# EasyEDA Pro project pcbs.epro

# Schematic Schematic1
Board Name: Mainboard; Create Date: 2025-03-07; Page Name: P1; Project Name: StratoSpore; Schematic Name: Schematic1; Update Date: 2025-05-23; Company: EasyEDA.com; Page Size: A4; Version: V1.0
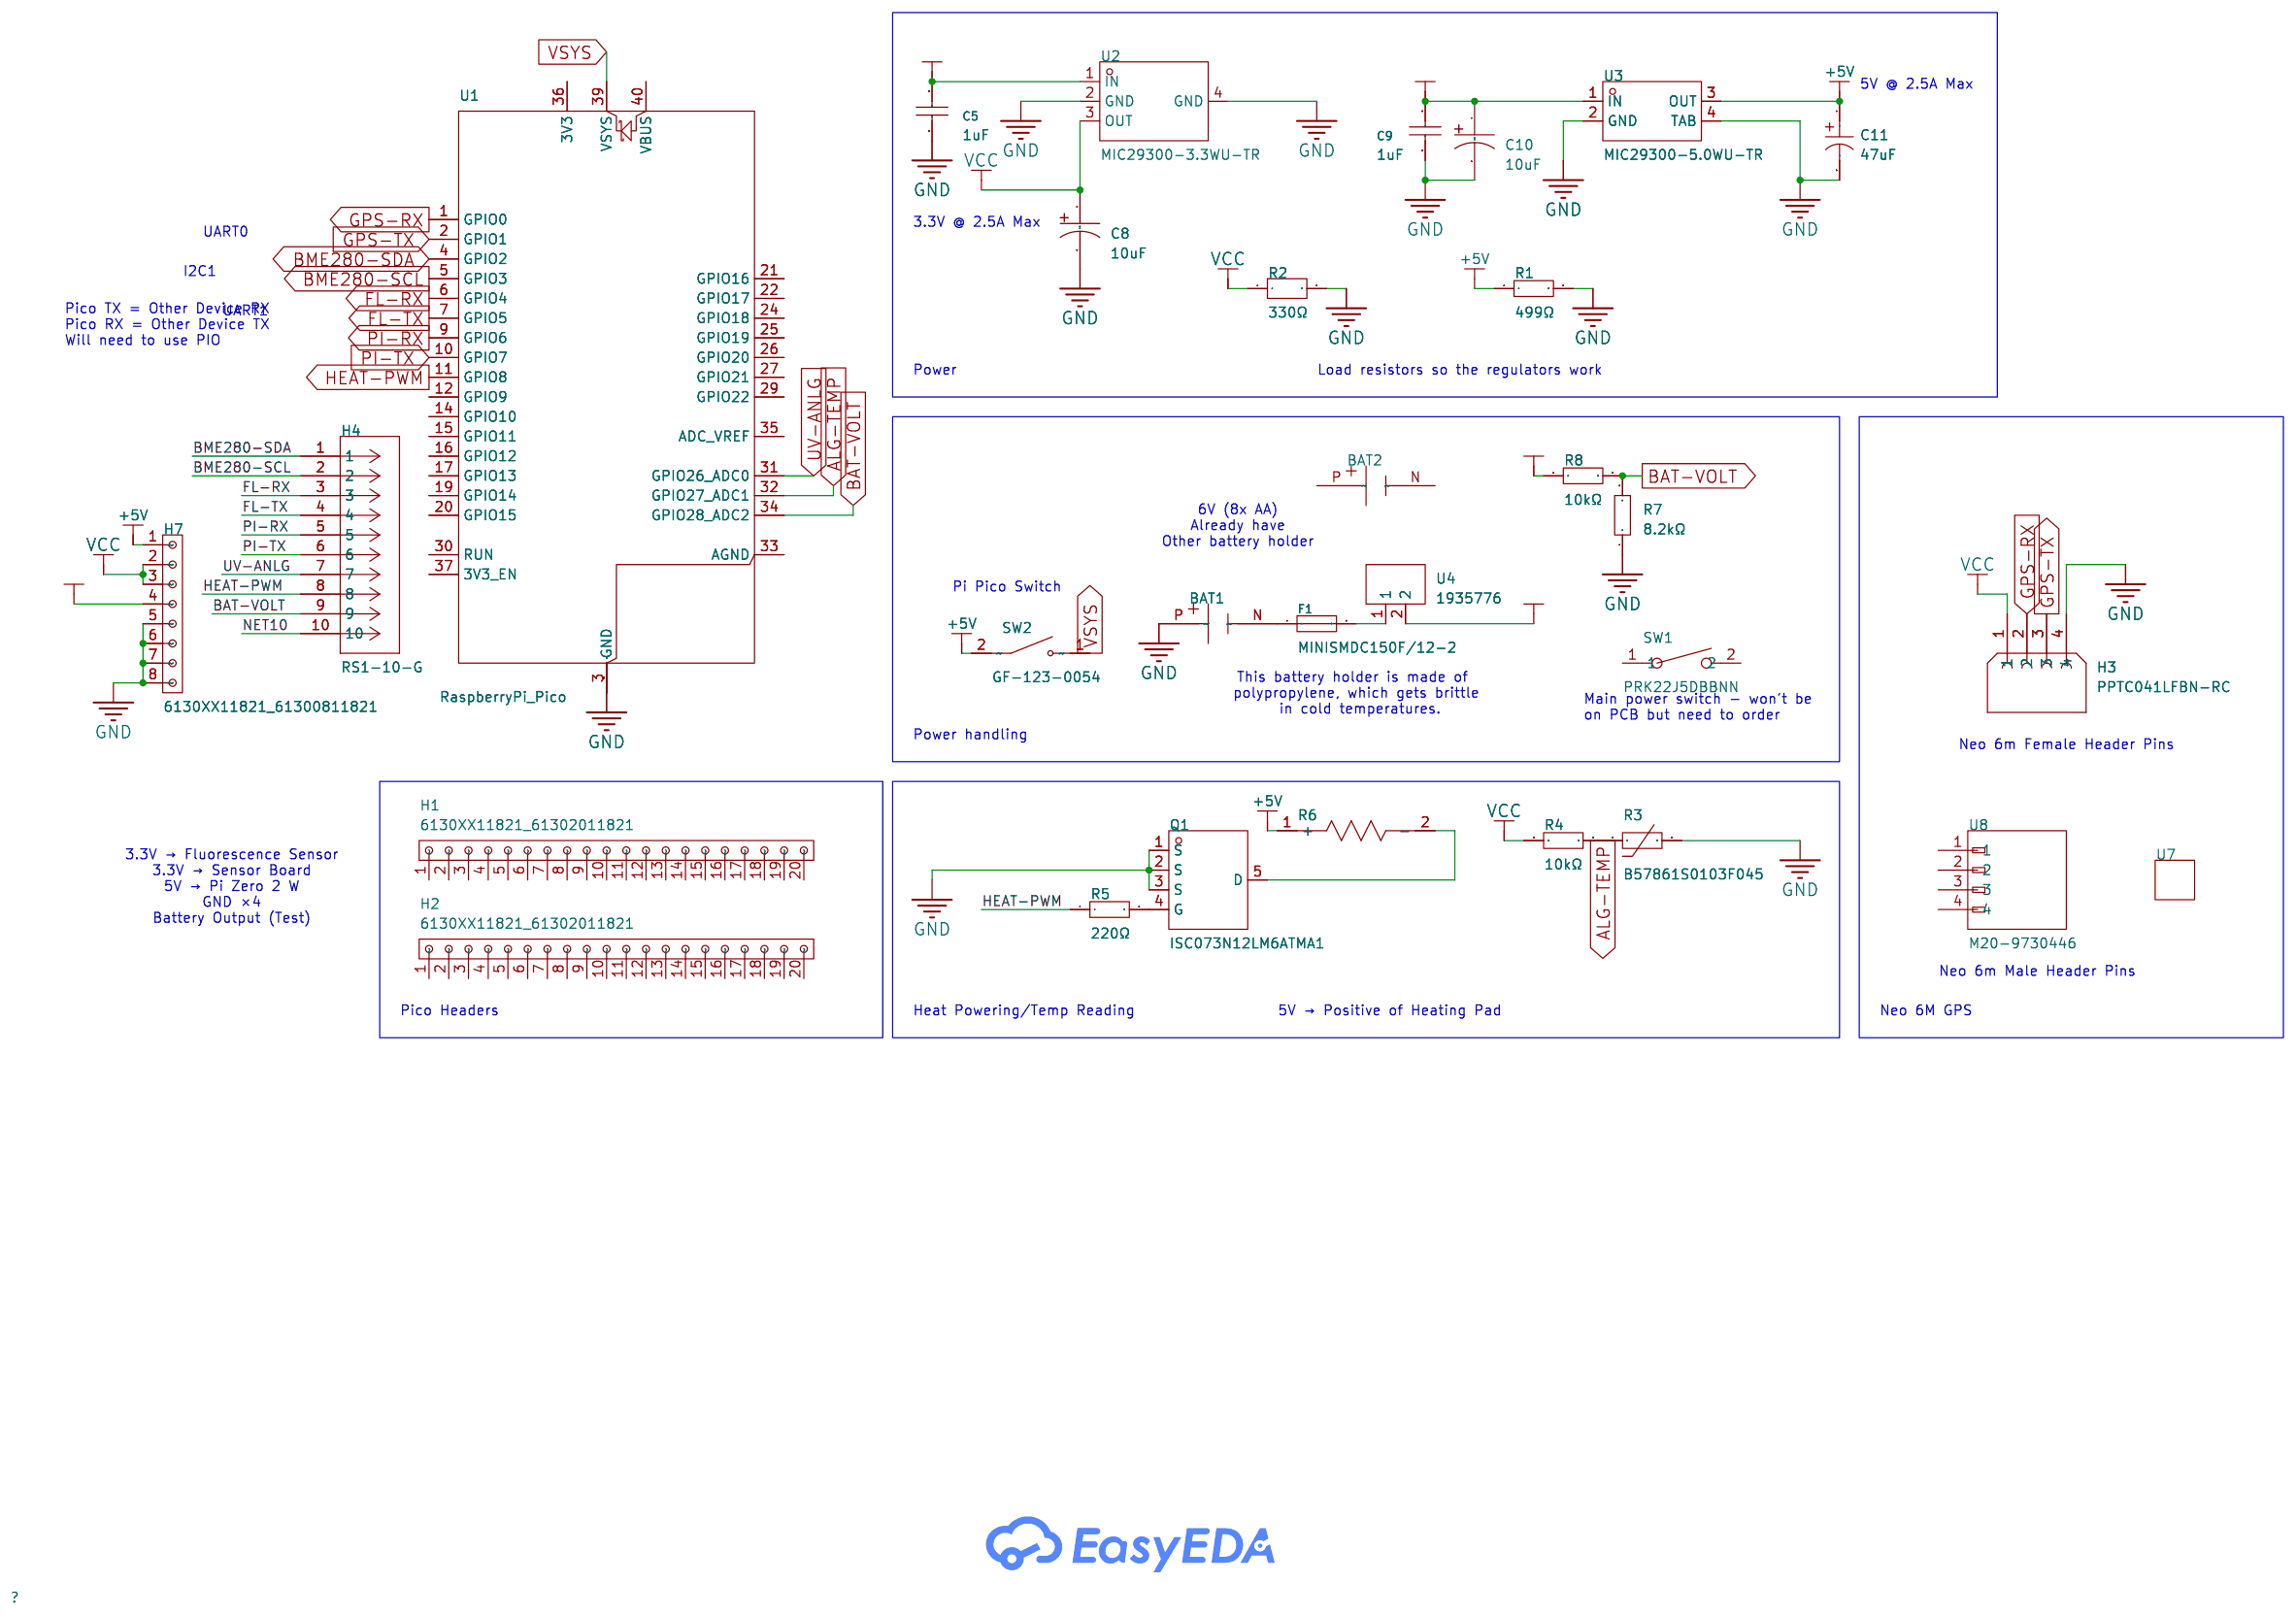
[diagram p0: schematic sheet]

## Parts
BAT1  -  [2478]
BAT2  -  [2478]
C5  1uF  [C0805]
C8  10uF  [CAP-SMD_L6.0-W3.2-R-RD]
C9  1uF  [C0805]
C10  10uF  [CAP-SMD_L6.0-W3.2-R-RD]
C11  47uF  [CAP-SMD_L7.3-W4.3-R-RD]
F1  MINISMDC150F/12-2  [F1812]
H1  6130XX11821_61302011821  [61302011821]
H2  6130XX11821_61302011821  [61302011821]
H3  PPTC041LFBN-RC  [SULLINS_PPTC041LFBN-RC]
H4  RS1-10-G  [CONN_RS1-10-G_ADM]
H7  6130XX11821_61300811821  [61300811821]
Q1  ISC073N12LM6ATMA1  [TDSON-8_L5.9-W5.2-P1.27-BL]
R1  499Ω  [R0603]
R2  330Ω  [R0603]
R3  B57861S0103F045  [RES-TH_BD2.4-P1.50-D0.3]
R4  10kΩ  [R0603]
R5  220Ω  [R0805]
R6  -  [1481]
R7  8.2kΩ  [R0603]
R8  10kΩ  [R0603]
SW1  PRK22J5DBBNN  [SW_PRK22J5DBBNN_ZFE]
SW2  GF-123-0054  [SW_GF-123-0054]
U1  RaspberryPi_Pico  [RaspberryPi_Pico_Common]
U2  MIC29300-3.3WU-TR  [TO-263-3_L8.6-W10.2-P2.54-LS14.4-BR]
U3  MIC29300-5.0WU-TR  [TO-263-3L_L10.2-W8.7-P2.54-LS15.3-BL-A]
U4  1935776  [CONN-TH_2P-P5.00_1935776]
U7  -  [neo 6m breakout]  (no BOM)
U8  M20-9730446  [HARWIN_M20-9730446]

## Library data of the parts
BAT1 BAT2 = 2478: Supplier Part: 36-2478-ND; Manufacturer: Keystone Electronics
C5 C9 = CC0805KKX7R8BB105: Capacitance: Tolerance:±10% Tolerance:±10% Voltage Rated: Temperature Coefficient:; LCSC Part Name: 1uF ±10% 25V; Supplier Part: C91186; Manufacturer: YAGEO(国巨); Supplier Footprint: 0805; JLCPCB Part Class: Extended Part; Datasheet: https://atta.szlcsc.com/upload/public/pdf/source/20170505/1493957848374.pdf; Supplier: LCSC; Tolerance: ±10%
C8 C10 = 293D106X0025C2TE3: Capacitance: Tolerance:±20% Tolerance:±20% Rated Voltage: Equivalent Series Resistance(ESR):1.5Ω@100kHz Operating Temperature:-55℃~+125℃ Operating Temperature:-55℃~+125℃; LCSC Part Name: 10uF ±20% 25V; Supplier Part: C506622; Manufacturer: VISHAY(威世); Supplier Footprint: CASE-C-6032; JLCPCB Part Class: Extended Part; Datasheet: https://atta.szlcsc.com/upload/public/pdf/source/20200402/C506568_4FDD8873788A7E9395A87829360D29B4.pdf; Supplier: LCSC; Tolerance: ±20%; Equivalent Series Resistance(ESR): 1.5Ω@100kHz; Operating Temperature: -55℃~+125℃
C11 = 293D476X9025E2TE3: Capacitance: Tolerance:±10% Tolerance:±10% Rated Voltage: Leakage Current(DCL):- Ripple Current:- Equivalent Series Resistance(ESR):600mΩ Operating Temperature:-55℃~+125℃ Operating Temperature:-55℃~+125℃; LCSC Part Name: 47uF ±10% 25V; Supplier Part: C1970968; Manufacturer: VISHAY(威世); Supplier Footprint: 2917; JLCPCB Part Class: Extended Part; Datasheet: https://atta.szlcsc.com/upload/public/pdf/source/20210430/5F5654738936DAF6EE15800967345E6B.pdf; Supplier: LCSC; Tolerance: ±10%; Equivalent Series Resistance(ESR): 600mΩ; Operating Temperature: -55℃~+125℃
F1 = MINISMDC150F/12-2: Operating Voltage (Max):12V Current Rating (Max):100A Hold Current:1.5A Trip Current:2.8A Power Dissipation:0.8W Resistance - Initial (Ri) (Min):40mΩ Resistance - Post Trip (R1) (Max):110mΩ Maximum Time to Trip:500ms Operating Temperature:-40℃~+85℃ Operat; LCSC Part Name: 12V 1.5A 1812自恢复; Supplier Part: C720177; Manufacturer: Littelfuse(美国力特); Supplier Footprint: 1812; JLCPCB Part Class: Extended Part; Datasheet: https://atta.szlcsc.com/upload/public/pdf/source/20190419/C207207_EAF573CD7DACFF875028B56E1335F153.pdf; Supplier: LCSC; Operating Voltage (Max): 12V; Current Rating (Max): 100A; Hold Current: 1.5A; Trip Current: 2.8A; Power Dissipation: 0.8W; Resistance - Initial (Ri) (Min): 40mΩ; Resistance - Post Trip (R1) (Max): 110mΩ; Maximum Time to Trip: 500ms; Operating Temperature: -40℃~+85℃
H1 H2 = 6130XX11821_61302011821: Supplier Part: 732-61302011821-ND; Manufacturer: Würth Elektronik
H3 = PPTC041LFBN-RC: Manufacturer: Sullins Connector Solutions; Supplier Part: S7002-ND
H4 = RS1-10-G: Manufacturer: Adam Tech; Supplier Part: 2057-RS1-10-G-ND
H7 = 6130XX11821_61300811821: Manufacturer: Würth Elektronik; Supplier Part: 732-61300811821-ND
Q1 = ISC073N12LM6ATMA1: Supplier Part: C20191682; Manufacturer: Infineon(英飞凌); Supplier Footprint: TDSON-8; JLCPCB Part Class: Extended Part; Datasheet: https://atta.szlcsc.com/upload/public/pdf/source/20240125/F6CF7D3B0298D52D159E06BBD68239CB.pdf; Supplier: LCSC
R1 = RC0603FR-07499RL: Type:Thick Film Resistors Resistance: Tolerance:±1% Tolerance:±1% Power(Watts): Overload Voltage (Max): Temperature Coefficient:±100ppm/℃ Temperature Coefficient:±100ppm/℃ Operating Temperature Range:-55℃~+155℃ Operating Temperature Range:-55℃~+155℃; LCSC Part Name: 厚膜电阻 499Ω ±1% 100mW; Supplier Part: C137714; Manufacturer: YAGEO(国巨); Supplier Footprint: 0603; JLCPCB Part Class: Extended Part; Datasheet: https://atta.szlcsc.com/upload/public/pdf/source/20180821/C275644_0D56F95EFF785E7D9A1FEF436B37DA78.pdf; Supplier: LCSC; Type: Thick Film Resistors; Tolerance: ±1%; Temperature Coefficient: ±100ppm/℃; Operating Temperature Range: -55℃~+155℃
R2 = AC0603FR-7W330RL: Type:Thick Film Resistors Resistance: Tolerance:±1% Tolerance:±1% Power(Watts): Temperature Coefficient:±100ppm/℃ Temperature Coefficient:±100ppm/℃ Operating Temperature:-55℃~+155℃ Operating Temperature:-55℃~+155℃; LCSC Part Name: 厚膜电阻 330Ω ±1% 200mW; Supplier Part: C513549; Manufacturer: YAGEO(国巨); Supplier Footprint: 0603; JLCPCB Part Class: Extended Part; Datasheet: https://atta.szlcsc.com/upload/public/pdf/source/20200720/C226560_9AA3C698ADB253A5478F88745DBE7B87.pdf; Supplier: LCSC; Type: Thick Film Resistors; Tolerance: ±1%; Temperature Coefficient: ±100ppm/℃; Operating Temperature: -55℃~+155℃
R3 = B57861S0103F045: Resistance @ 25℃:10kΩ B Constant (25℃/100℃):3988K Power(Watts):60mW B Constant Tolerance:±0.3% Operating Temperature:-55℃~+155℃ Operating Temperature:-55℃~+155℃; Supplier Part: C3153632; Manufacturer: TDK; JLCPCB Part Class: Extended Part; Datasheet: https://atta.szlcsc.com/upload/public/pdf/source/231023/C17239155-3a32f035bd59906d9ea9e0c8483bf3a3.pdf; Supplier: LCSC; Resistance @ 25℃: 10kΩ; B Constant (25℃/100℃): 3988K; Power(Watts): 60mW; B Constant Tolerance: ±0.3%; Operating Temperature: -55℃~+155℃
R4 = RC0603FR-0710KL: Type:Thick Film Resistors Resistance: Tolerance:±1% Tolerance:±1% Power(Watts): Overload Voltage (Max): Temperature Coefficient:±100ppm/℃ Temperature Coefficient:±100ppm/℃ Operating Temperature Range:-55℃~+155℃ Operating Temperature Range:-55℃~+155℃; LCSC Part Name: 厚膜电阻 10kΩ ±1% 100mW; Supplier Part: C98220; Manufacturer: YAGEO(国巨); Supplier Footprint: 0603; JLCPCB Part Class: Extended Part; Datasheet: https://atta.szlcsc.com/upload/public/pdf/source/20180927/C295883_E8D83085EA81BD7DE0B2B681138C15EE.pdf; Supplier: LCSC; Type: Thick Film Resistors; Tolerance: ±1%; Temperature Coefficient: ±100ppm/℃; Operating Temperature Range: -55℃~+155℃
R5 = RC0805JR-7W220RL: Type:Thick Film Resistors Resistance: Tolerance:±5% Tolerance:±5% Power(Watts):250mW Overload Voltage (Max): Temperature Coefficient:±100ppm/℃ Temperature Coefficient:±100ppm/℃ Operating Temperature Range:-55℃~+155℃ Operating Temperature Range:-55℃~+155℃; LCSC Part Name: 厚膜电阻 220Ω ±5% 250mW; Supplier Part: C163392; Manufacturer: YAGEO(国巨); Supplier Footprint: 0805; JLCPCB Part Class: Extended Part; Datasheet: https://atta.szlcsc.com/upload/public/pdf/source/20181009/C309620_DA5935B6E1D48212CB7A533FE518B3C2.pdf; Supplier: LCSC; Type: Thick Film Resistors; Tolerance: ±5%; Power(Watts): 250mW; Temperature Coefficient: ±100ppm/℃; Operating Temperature Range: -55℃~+155℃
R6 = 1481: Supplier Part: 1528-1481AD-ND; Manufacturer: Adafruit Industries LLC
R7 = RC0603JR-078K2L: Type:Thick Film Resistors Resistance: Tolerance:±5% Tolerance:±5% Power(Watts): Overload Voltage (Max): Temperature Coefficient:±100ppm/℃ Temperature Coefficient:±100ppm/℃ Operating Temperature Range:-55℃~+155℃ Operating Temperature Range:-55℃~+155℃; LCSC Part Name: 厚膜电阻 8.2kΩ ±5% 100mW; Supplier Part: C137605; Manufacturer: YAGEO(国巨); Supplier Footprint: 0603; JLCPCB Part Class: Extended Part; Datasheet: https://atta.szlcsc.com/upload/public/pdf/source/20180821/C275644_0D56F95EFF785E7D9A1FEF436B37DA78.pdf; Supplier: LCSC; Type: Thick Film Resistors; Tolerance: ±5%; Temperature Coefficient: ±100ppm/℃; Operating Temperature Range: -55℃~+155℃
R8 = RC0603FR-7W10KL: Type:Thick Film Resistors Resistance: Tolerance:±1% Tolerance:±1% Power(Watts): Overload Voltage (Max): Temperature Coefficient:±200ppm/℃ Temperature Coefficient:±200ppm/℃ Operating Temperature Range:-55℃~+155℃ Operating Temperature Range:-55℃~+155℃; LCSC Part Name: 厚膜电阻 10kΩ ±1% 200mW; Supplier Part: C859110; Manufacturer: YAGEO(国巨); Supplier Footprint: 0603; JLCPCB Part Class: Extended Part; Datasheet: https://atta.szlcsc.com/upload/public/pdf/source/20200729/C77617_95A5CB0DA5B36E247059EF653C0CC0E3.pdf; Supplier: LCSC; Type: Thick Film Resistors; Tolerance: ±1%; Temperature Coefficient: ±200ppm/℃; Operating Temperature Range: -55℃~+155℃
SW1 = PRK22J5DBBNN: Supplier Part: CH865-ND
SW2 = GF-123-0054: Manufacturer: CW Industries; Supplier Part: CWI333-ND
U1 = RaspberryPi_Pico
U2 = MIC29300-3.3WU-TR: Output Type:Fixed Maximum Input Voltage:26V Output Voltage:3.3V Output Voltage:3.3V Output Current:3A Power Supply Rejection Ratio (PSRR):- Dropout Voltage:600mV@(3A) Feature:ESD Protection；Thermal Protection(TSD)；Overcurrent Protection(OCP)；Overvoltage P; LCSC Part Name: 输入26V 输出3.3V 3A; Supplier Part: C481370; Manufacturer: MICROCHIP(美国微芯); Supplier Footprint: TO-263-3; JLCPCB Part Class: Extended Part; Datasheet: https://atta.szlcsc.com/upload/public/pdf/source/20210319/C632728_21C2D58688A9F27E0B2DBAFC6F66A269.pdf; Supplier: LCSC; Output Type: Fixed; Maximum Input Voltage: 26V; Output Voltage: 3.3V; Output Current: 3A; Dropout Voltage: 600mV@(3A); Feature: ESD Protection；Thermal Protection(TSD)；Overcurrent Protection(OCP)；Overvoltage Protection (OVP); Operating Temperature: -40℃~+125℃; Output Polarity: Positive electrode; Number of Outputs: 1
U3 = MIC29300-5.0WU-TR: Output Type:Fixed Maximum Input Voltage:26V Output Voltage:5V Output Voltage:5V Output Current:3A Dropout Voltage:600mV@(3A) Feature:ESD Protection；Thermal Protection(TSD)；Overcurrent Protection(OCP)；Overvoltage Protection (OVP) Operating Temperature:-40℃; Supplier Part: C632729; Manufacturer: MICROCHIP(美国微芯); Supplier Footprint: TO-263-3; JLCPCB Part Class: Extended Part; Datasheet: https://atta.szlcsc.com/upload/public/pdf/source/20210319/C632728_21C2D58688A9F27E0B2DBAFC6F66A269.pdf; Supplier: LCSC; Output Type: Fixed; Maximum Input Voltage: 26V; Output Voltage: 5V; Output Current: 3A; Dropout Voltage: 600mV@(3A); Feature: ESD Protection；Thermal Protection(TSD)；Overcurrent Protection(OCP)；Overvoltage Protection (OVP); Operating Temperature: -40℃~+125℃; Output Polarity: Positive electrode; Number of Outputs: 1
U4 = 1935776: Number of Positions or Pins:1x2P Pitch:5mm Color:Green Mounting Type:Direct Insert Number of Pins:2P Number of Rows:1 Number of PINs Per Row:2 Current Rating:20A Voltage Rating (Max):300V Wire Gauge - AWG:12~20 Wire Gauge - AWG:12~20 Operating Temperature; LCSC Part Name: 5mm 1x2P 排数:1 每排P数:2 直插; Supplier Part: C3817389; Manufacturer: Phoenix Contact(菲尼克斯); Supplier Footprint: 插件,P=5mm; JLCPCB Part Class: Extended Part; Datasheet: https://atta.szlcsc.com/upload/public/pdf/source/20241031/6A5BF2121E40199BEDD4CC643D0B5C53.pdf; Supplier: LCSC; Number of Positions or Pins: 1x2P; Pitch: 5mm; Color: Green; Mounting Type: Direct Insert; Number of Pins: 2P; Number of Rows: 1; Number of PINs Per Row: 2; Current Rating: 20A; Voltage Rating (Max): 300V; Wire Gauge - AWG: 12~20
U7 = neo 6m breakout
U8 = M20-9730446

## Nets
+5V: C11.1 H7.1 R1.1 R6.1(+) SW2.2 U3.3(OUT)
+6V: C5.2 C9.2 C10.1 H7.4 R8.1 U2.1(IN) U3.1(IN) U4.2
GND: BAT1.P C5.1 C8.2 C9.1 C10.2 C11.2 H3.4 H7.5 H7.6 H7.7 H7.8 Q1.1(S) Q1.2(S) Q1.3(S) R1.2 R2.2 R3.2 R7.1 U1.3(GND) U1.8(GND) U1.13(GND) U1.18(GND) U1.23(GND) U1.28(GND) U1.38(GND) U2.2(GND) U2.4(GND) U3.2(GND) U3.4(TAB)
VCC: C8.1 H3.1 H7.2 H7.3 R2.1 R4.1 U2.3(OUT)
ALG-TEMP: R3.1 R4.2 U1.32(GPIO27_ADC1)
BAT-VOLT: H4.9 R7.2 R8.2 U1.34(GPIO28_ADC2)
BME280-SCL: H4.2 U1.5(GPIO3)
BME280-SDA: H4.1 U1.4(GPIO2)
FL-RX: H4.3 U1.6(GPIO4)
FL-TX: H4.4 U1.7(GPIO5)
GPS-RX: H3.2 U1.1(GPIO0)
GPS-TX: H3.3 U1.2(GPIO1)
HEAT-PWM: H4.8 R5.1 U1.11(GPIO8)
NET10: H4.10
PI-RX: H4.5 U1.9(GPIO6)
PI-TX: H4.6 U1.10(GPIO7)
UV-ANLG: H4.7 U1.31(GPIO26_ADC0)
VSYS: SW2.1 U1.39(VSYS)
$1N15688: F1.2 U4.1
$1N19014: Q1.4(G) R5.2
$1N19161: Q1.5(D) R6.2(-)
$1N22706: BAT1.N F1.1

Not connected (* = marked no-connect by the designer): BAT2 N P; H1 1 2 3 4 5 6 7 8 9 10 11 12 13 14 15 16 17 18 19 20; H2 1 2 3 4 5 6 7 8 9 10 11 12 13 14 15 16 17 18 19 20; SW1 1 2; U1 12(GPIO9) 14(GPIO10) 15(GPIO11) 16(GPIO12) 17(GPIO13) 19(GPIO14) 20(GPIO15) 21(GPIO16) 22(GPIO17) 24(GPIO18) 25(GPIO19) 26(GPIO20) 27(GPIO21) 29(GPIO22) 30(RUN) 33(AGND) 35(ADC_VREF) 36(3V3) 37(3V3_EN) 40(VBUS); U8 1 2 3 4

## Notes on the sheet
- 5V @ 2.5A Max
- 3.3V @ 2.5A Max
- UART0
- I2C1
- UART1
- Pico TX = Other Device RX
  Pico RX = Other Device TX
  Will need to use PIO
- Power
- Load resistors so the regulators work
- 6V (8x AA)
  Already have
  Other battery holder
- Pi Pico Switch
- This battery holder is made of
  polypropylene, which gets brittle
   in cold temperatures.
- Main power switch - won't be
  on PCB but need to order
- Power handling
- Neo 6m Female Header Pins
- 3.3V → Fluorescence Sensor
  3.3V → Sensor Board
  5V → Pi Zero 2 W
  GND ×4
  Battery Output (Test)
- Neo 6m Male Header Pins
- Pico Headers
- Heat Powering/Temp Reading
- 5V → Positive of Heating Pad
- Neo 6M GPS

# Schematic Schematic2
Board Name: FluorescenceDetector; Create Date: 2025-03-17; Page Name: P1; Project Name: StratoSpore; Schematic Name: Schematic2; Update Date: 2025-05-09; Company: EasyEDA.com; Page Size: A4; Version: V1.0
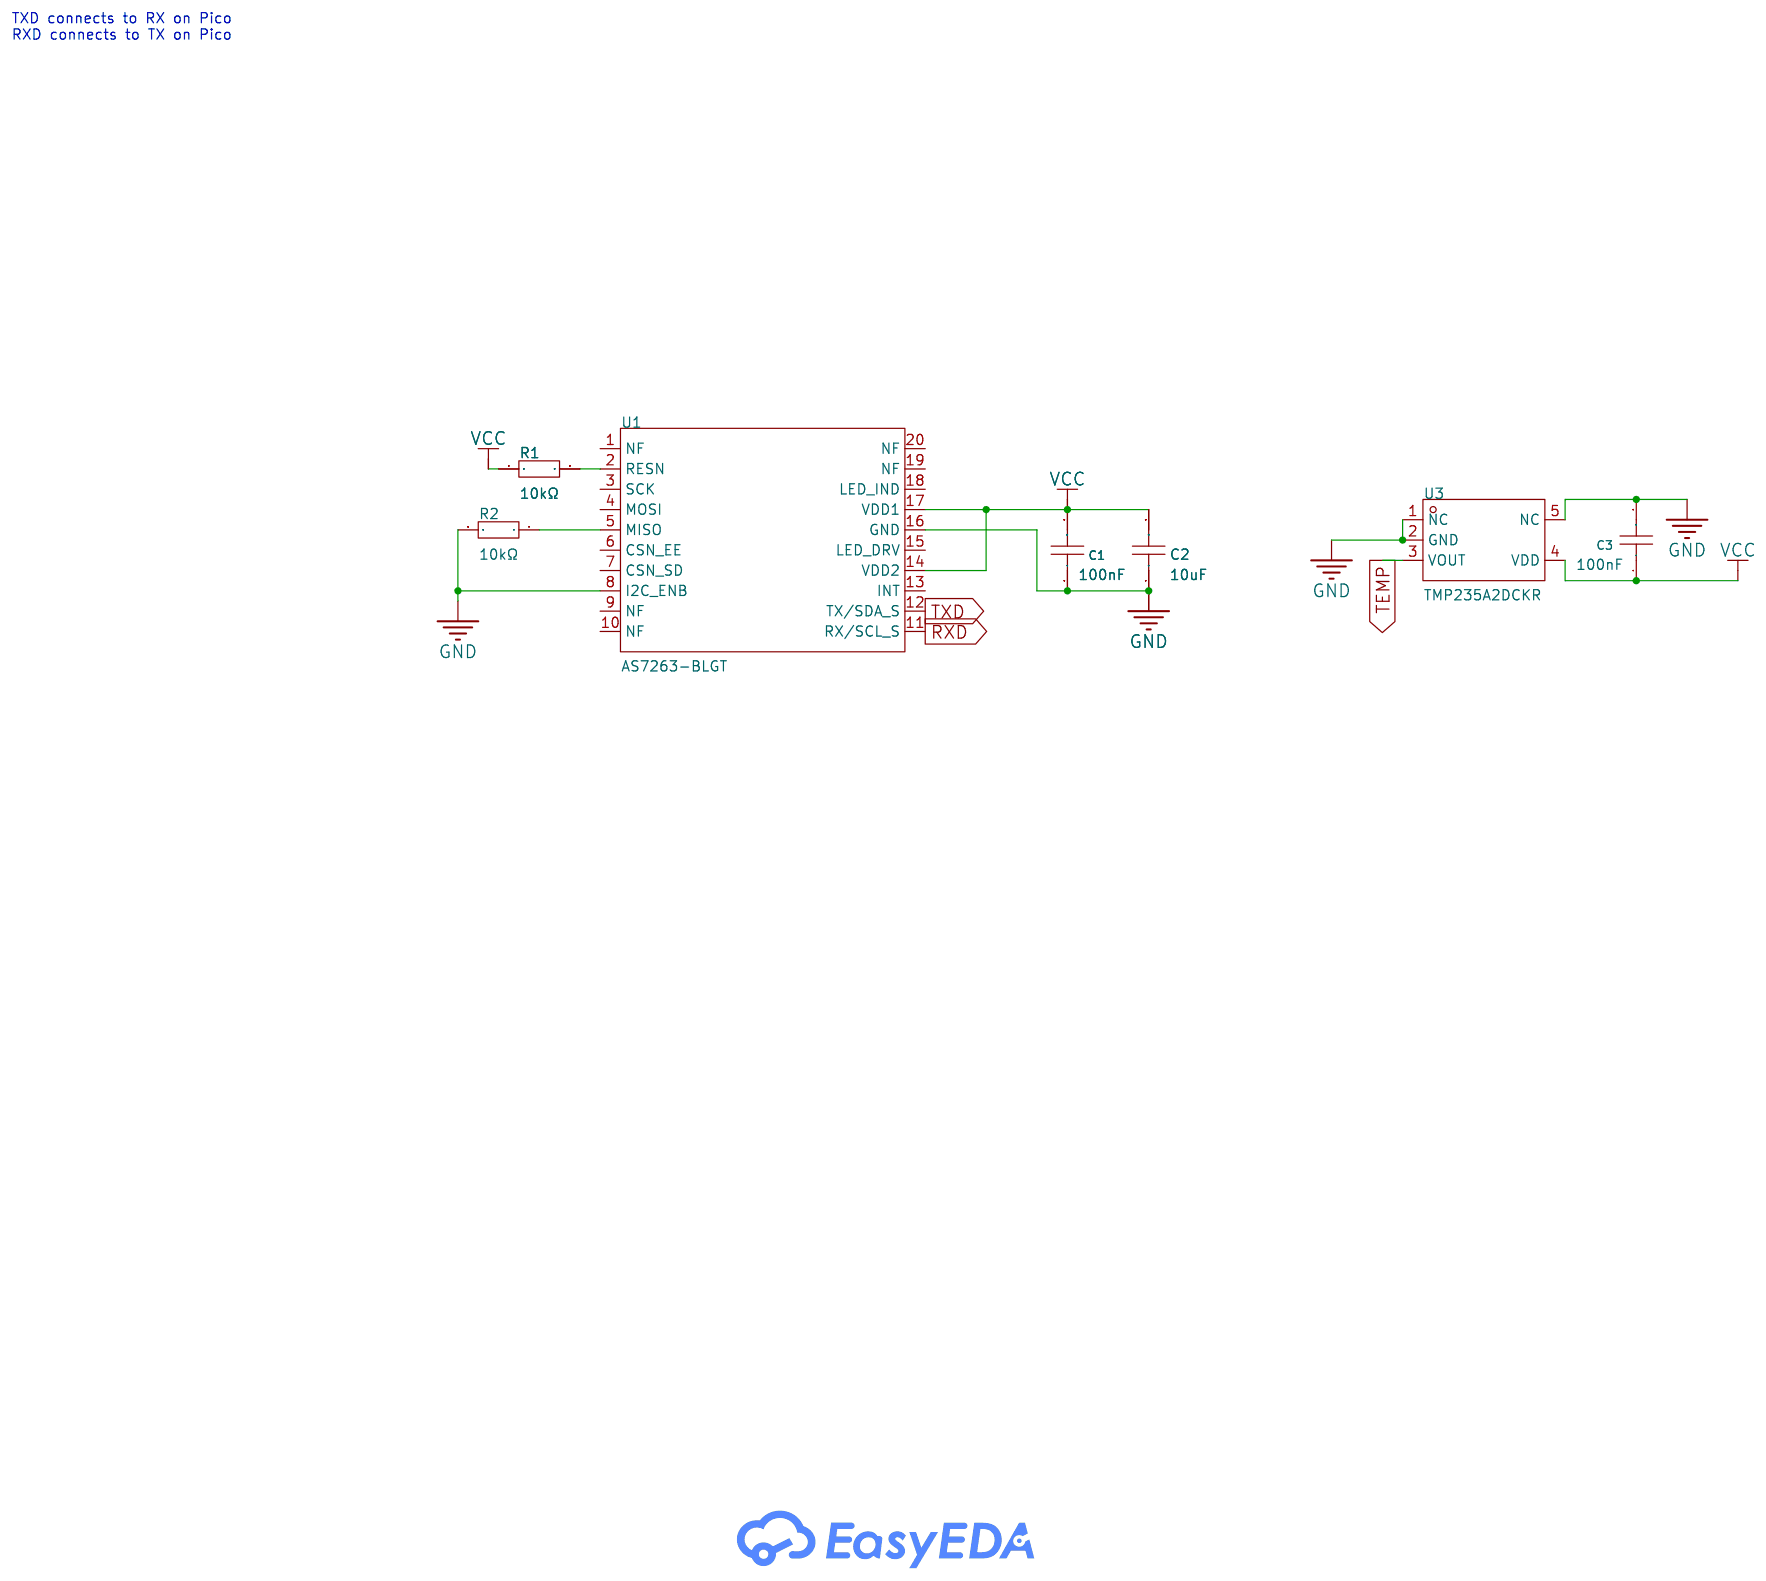
[diagram p1: schematic sheet]

## Parts
C1  100nF  [C0603]
C2  10uF  [C0603]
C3  100nF  [C0603]
R1  10kΩ  [R0603]
R2  10kΩ  [R0603]
U1  AS7263-BLGT  [LGA-20_L4.7-W4.5-P0.65-TL]
U3  TMP235A2DCKR  [SC-70-5_L2.0-W1.3-P0.65-LS2.1-BR]

## Library data of the parts
C1 C3 = CC0603JRX7R8BB104: Capacitance: Tolerance:±5% Tolerance:±5% Voltage Rated: Temperature Coefficient:; LCSC Part Name: 100nF ±5% 25V; Supplier Part: C327087; Manufacturer: YAGEO(国巨); Supplier Footprint: 0603; JLCPCB Part Class: Extended Part; Datasheet: https://atta.szlcsc.com/upload/public/pdf/source/20181031/C327087_3904F8991912FFA736313896A6BE2AA9.pdf; Supplier: LCSC; Tolerance: ±5%
C2 = LMK107BBJ106MALT: Capacitance: Tolerance:±20% Tolerance:±20% Voltage Rating: Temperature Coefficient:; LCSC Part Name: MSASL168BB5106MTNB33 10uF ±20% 10V; Supplier Part: C195004; Manufacturer: TAIYO YUDEN(太诱); Supplier Footprint: 0603; JLCPCB Part Class: Extended Part; Datasheet: https://atta.szlcsc.com/upload/public/pdf/source/20210525/C2802164_C0429B055888A674C3F00BA74B841C5B.pdf; Supplier: LCSC; Tolerance: ±20%
R1 R2 = RC0603FR-0710KL: Type:Thick Film Resistors Resistance: Tolerance:±1% Tolerance:±1% Power(Watts): Overload Voltage (Max): Temperature Coefficient:±100ppm/℃ Temperature Coefficient:±100ppm/℃ Operating Temperature Range:-55℃~+155℃ Operating Temperature Range:-55℃~+155℃; LCSC Part Name: 厚膜电阻 10kΩ ±1% 100mW; Supplier Part: C98220; Manufacturer: YAGEO(国巨); Supplier Footprint: 0603; JLCPCB Part Class: Extended Part; Datasheet: https://atta.szlcsc.com/upload/public/pdf/source/20180927/C295883_E8D83085EA81BD7DE0B2B681138C15EE.pdf; Supplier: LCSC; Type: Thick Film Resistors; Tolerance: ±1%; Temperature Coefficient: ±100ppm/℃; Operating Temperature Range: -55℃~+155℃
U1 = AS7263-BLGT: Voltage - Supply:2.7V~3.6V Voltage - Supply:2.7V~3.6V Operating Temperature:-40℃~+85℃ Operating Temperature:-40℃~+85℃; LCSC Part Name: AS7263 BLGT; Supplier Part: C2655137; Manufacturer: ams(艾迈斯半导体); Supplier Footprint: LGA-20(4.5x4.7); JLCPCB Part Class: Extended Part; Datasheet: https://atta.szlcsc.com/upload/public/pdf/source/20210505/18C99F95497B8F7878D6A74D756655C4.pdf; Supplier: LCSC; Voltage - Supply: 2.7V~3.6V; Operating Temperature: -40℃~+85℃
U3 = TMP235A2DCKR: Resolution:±0.5℃ Resolution:±0.5℃ Supply Voltage:2.3V~5.5V Supply Voltage:2.3V~5.5V; Supplier Part: C2872116; Manufacturer: TI(德州仪器); Supplier Footprint: SC-70-5; JLCPCB Part Class: Extended Part; Datasheet: https://www.ti.com/cn/lit/gpn/tmp235; Supplier: LCSC; Resolution: ±0.5℃; Supply Voltage: 2.3V~5.5V

## Nets
GND: C1.1 C2.1 C3.2 R2.2 U1.8(I2C_ENB) U1.16(GND) U3.1(NC) U3.2(GND) U3.5(NC)
VCC: C1.2 C2.2 C3.1 R1.1 U1.14(VDD2) U1.17(VDD1) U3.4(VDD)
RXD: U1.11(RX/SCL_S)
TEMP: U3.3(VOUT)
TXD: U1.12(TX/SDA_S)
$1N5136: R1.2 U1.2(RESN)
$1N6346: R2.1 U1.5(MISO)

Not connected (* = marked no-connect by the designer): U1 1(NF) 3(SCK) 4(MOSI) 6(CSN_EE) 7(CSN_SD) 9(NF) 10(NF) 13(INT) 15(LED_DRV) 18(LED_IND) 19(NF) 20(NF)

## Notes on the sheet
- TXD connects to RX on Pico
  RXD connects to TX on Pico

# Schematic Schematic3
Board Name: SensorBoard; Create Date: 2025-03-28; Page Name: P1; Project Name: StratoSpore; Schematic Name: Schematic3; Update Date: 2025-05-09; Company: EasyEDA.com; Page Size: A4; Version: V1.0
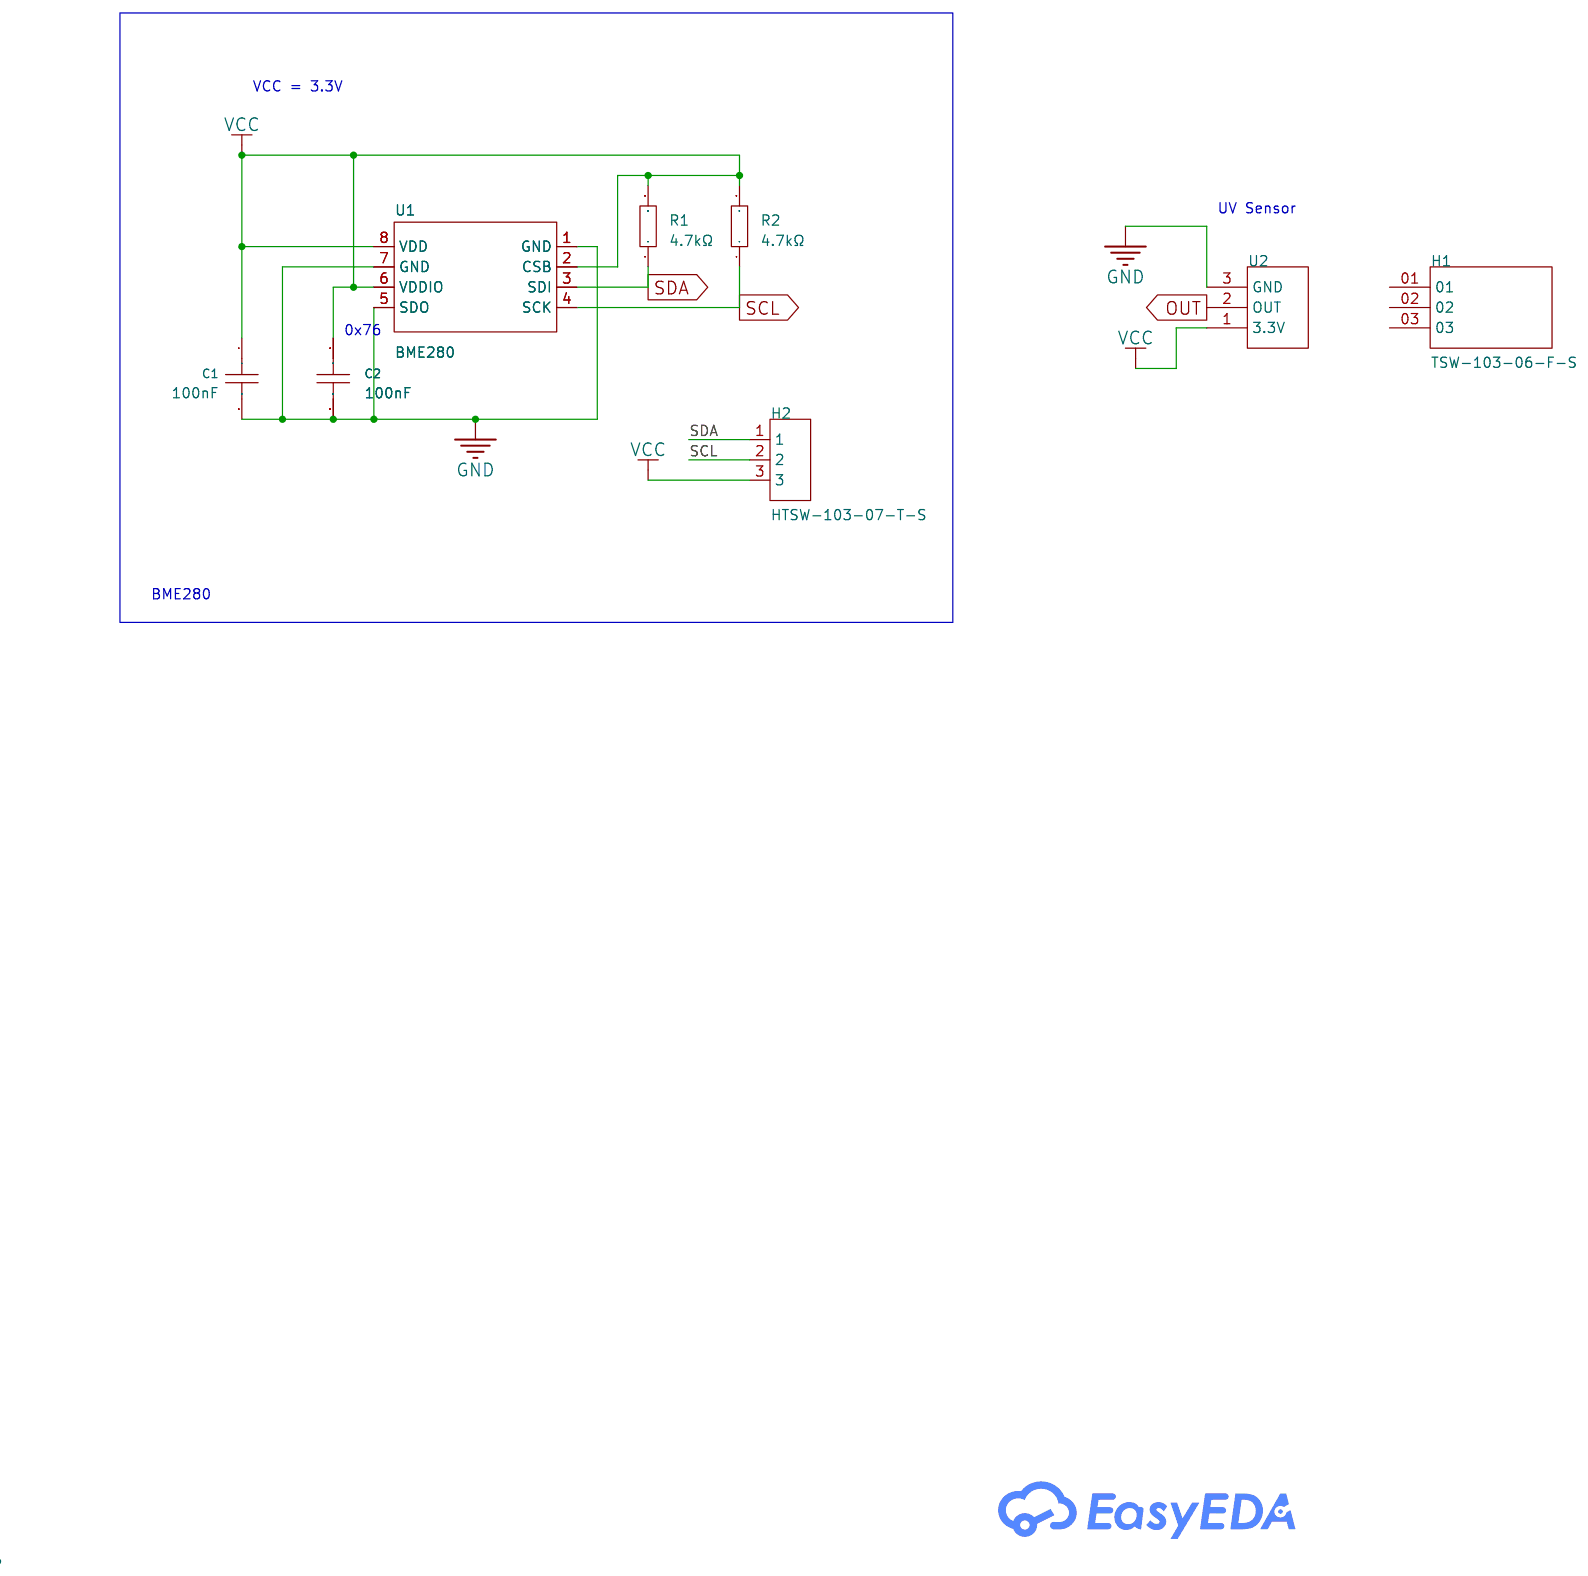
[diagram p2: schematic sheet]

## Parts
C1  100nF  [C0603]
C2  100nF  [C0603]
H1  TSW-103-06-F-S  [SAMTEC_TSW-103-06-F-S]
H2  HTSW-103-07-T-S  [HDR-TH_3P-P2.54-V-M]
R1  4.7kΩ  [R0603]
R2  4.7kΩ  [R0603]
U1  BME280  [LGA-8_BME280_BL]
U2  -  [1918]

## Library data of the parts
C1 C2 = CC0603JRX7R8BB104: Capacitance: Tolerance:±5% Tolerance:±5% Voltage Rated: Temperature Coefficient:; LCSC Part Name: 100nF ±5% 25V; Supplier Part: C327087; Manufacturer: YAGEO(国巨); Supplier Footprint: 0603; JLCPCB Part Class: Extended Part; Datasheet: https://atta.szlcsc.com/upload/public/pdf/source/20181031/C327087_3904F8991912FFA736313896A6BE2AA9.pdf; Supplier: LCSC; Tolerance: ±5%
H1 = TSW-103-06-F-S: Manufacturer: Samtec Inc.; Supplier Part: TSW-103-06-F-S-ND
H2 = HTSW-103-07-T-S: Pitch:2.54mm Mounting Type:Straight Number of Rows:Single Row Number of Pins:3P Contact Material:Phosphor Bronze Contact Plating:Tin Operating Temperature:-55℃~+105℃ Operating Temperature:-55℃~+105℃; LCSC Part Name: 间距:2.54mm 直插; Supplier Part: C5762622; Manufacturer: SAMTEC; Supplier Footprint: 插件,P=2.54mm; JLCPCB Part Class: Extended Part; Datasheet: https://atta.szlcsc.com/upload/public/pdf/source/20230428/741833D6B396B73F25D457C752682A0D.pdf; Supplier: LCSC; Pitch: 2.54mm; Mounting Type: Straight; Number of Rows: Single Row; Number of Pins: 3P; Contact Material: Phosphor Bronze; Contact Plating: Tin; Operating Temperature: -55℃~+105℃
R1 R2 = RC0603FR-074K7L: Type:Thick Film Resistors Resistance: Tolerance:±1% Tolerance:±1% Power(Watts): Overload Voltage (Max): Temperature Coefficient:±100ppm/℃ Temperature Coefficient:±100ppm/℃ Operating Temperature Range:-55℃~+155℃ Operating Temperature Range:-55℃~+155℃; LCSC Part Name: 厚膜电阻 4.7kΩ ±1% 100mW; Supplier Part: C99782; Manufacturer: YAGEO(国巨); Supplier Footprint: 0603; JLCPCB Part Class: Extended Part; Datasheet: https://atta.szlcsc.com/upload/public/pdf/source/20180224/C181757_15194369480721363983.pdf; Supplier: LCSC; Type: Thick Film Resistors; Tolerance: ±1%; Temperature Coefficient: ±100ppm/℃; Operating Temperature Range: -55℃~+155℃
U1 = BME280: Voltage - Supply:1.71V~3.6V Voltage - Supply:1.71V~3.6V; LCSC Part Name: 湿度：0%RH~100%RH; Supplier Part: C92489; Manufacturer: Bosch(博世); Supplier Footprint: LGA-8(2.5x2.5); JLCPCB Part Class: Extended Part; Datasheet: https://atta.szlcsc.com/upload/public/pdf/source/20230217/9358ECB1DA7C52D8F39392648E599102.pdf; Supplier: LCSC; Voltage - Supply: 1.71V~3.6V
U2 = 1918: ANALOG UV SENSOR BREAKOUT; Manufacturer: Adafruit Industries LLC; Supplier Part: 1528-1468-ND

## Nets
GND: C1.2 C2.2 U1.1(GND) U1.5(SDO) U1.7(GND) U2.3(GND)
VCC: C1.1 C2.1 H2.3 R1.2 R2.2 U1.2(CSB) U1.6(VDDIO) U1.8(VDD) U2.1(3.3V)
OUT: U2.2(OUT)
SCL: H2.2 R2.1 U1.4(SCK)
SDA: H2.1 R1.1 U1.3(SDI)

Not connected (* = marked no-connect by the designer): H1 01 02 03

## Notes on the sheet
- VCC = 3.3V
- UV Sensor
- 0x76
- BME280

# Board PCB2
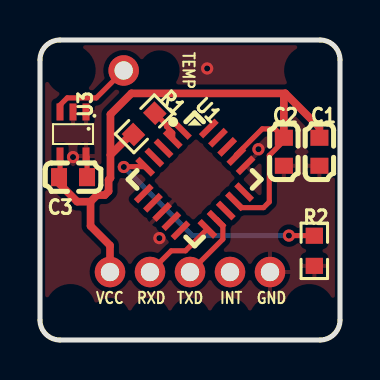
[diagram p3: board, top side]
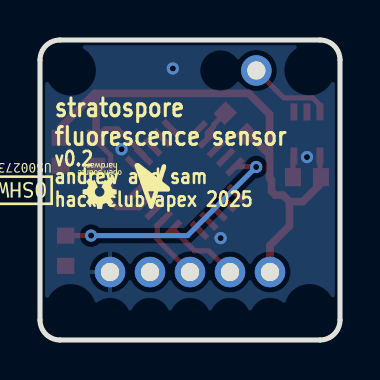
[diagram p4: board, bottom side, seen from below]

Outline 15 x 15 mm; copper layers: Top Layer, Bottom Layer. Coordinates in mm from the lower left corner of the outline.
Outline path: 0,14 0,1 arc(0.29,0.29) 1,0 14,0 arc(14.71,0.29) 15,1 15,14 arc(14.71,14.71) 14,15 1,15 arc(0.29,14.71) 0,14
Stack: Top Layer 0.0711mm / Dielectric1 0.71mm FR4 er 4.5 / Bottom Layer 0.0711mm

## Design rules (mm)
template: OSH Park 0.8mm 2oz
spacing copperThickness1oz (default): track to track 0.102, other pairs 0.152 to 0.3
spacing copperThickness2oz: track to track 0.203, other pairs 0.152 to 0.3
track width copperThickness1oz (default): min 0.127, default 0.254, max 2.54
track width copperThickness2oz: min 0.203, default 0.254, max 2.54
differential pair differentialPair (default): width min 0.127, default 0.254, max 2.54; gap min 0.152, default 0.152
via viaSize (default): diameter min 0.5, default 0.61, max 10; hole min 0.3, default 0.305, max 6.3

## Placement (name value [footprint] x y rotation side)
C1  100nF  [C0603]  13.97 9.41 90 top
C2  10uF  [C0603]  12.19 9.41 90 top
C3  100nF  [C0603]  1.65 8.14 0 top
NOREF  -  [Pad_e33]  3.5 3.4 0 top
NOREF#2  -  [Pad_e479]  4.18 13.48 90 top
NOREF#3  -  [Pad_e34]  5.5 3.4 0 top
NOREF#4  -  [Pad_e38]  11.5 3.4 0 top
NOREF#5  -  [Pad_e37]  9.5 3.4 0 top
NOREF#6  -  [Pad_e36]  7.5 3.4 0 top
R1  10kΩ  [R0603]  5.21 10.81 45 top
R2  10kΩ  [R0603]  13.72 4.46 270 top
U1  AS7263-BLGT  [LGA-20_L4.7-W4.5-P0.65-TL]  7.73 8.03 315 top
U3  TMP235A2DCKR  [SC-70-5_L2.0-W1.3-P0.65-LS2.1-BR]  1.65 10.3 90 top

## Footprints (pads in the part's own frame, mm; a bottom-side part is the same pattern mirrored in y, then rotated)
C0603
  rect 0.8x0.9 smd: 1(-0.7,0) 2(0.7,0)
LGA-20_L4.7-W4.5-P0.65-TL
  rect 1.1x0.3 smd: 1(-2.2,1.3) 2(-2.2,0.65) 3(-2.2,0) 4(-2.2,-0.65) 5(-2.2,-1.3) 11(2.2,-1.3) 12(2.2,-0.65) 13(2.2,0) 14(2.2,0.65) 15(2.2,1.3)
  rect 0.3x1.1 smd: 6(-1.3,-2.3) 7(-0.65,-2.3) 8(0,-2.3) 9(0.65,-2.3) 10(1.3,-2.3) 16(1.3,2.3) 17(0.65,2.3) 18(0,2.3) 19(-0.65,2.3) 20(-1.3,2.3)
Pad_e33
  round 1.524 hole 0.914: 1(0,0)
Pad_e34
  round 1.524 hole 0.914: 2(0,0)
Pad_e36
  round 1.524 hole 0.914: 2(0,0)
Pad_e37
  round 1.524 hole 0.914: 2(0,0)
Pad_e38
  round 1.524 hole 0.914: 2(0,0)
Pad_e479
  round 1.524 hole 0.914: 1(0,0)
R0603
  rect 0.806x0.864 smd: 1(-0.753,0) 2(0.753,0)
SC-70-5_L2.0-W1.3-P0.65-LS2.1-BR
  rect 0.85x0.35 smd: 1(1.1,-0.65) 2(1.1,0) 3(1.1,0.65) 4(-1.1,0.65) 5(-1.1,-0.65)

## Nets
GND: C1.1 C2.1 C3.2 NOREF#4.2 R2.2 U1.8 U1.16 U3.1 U3.2 U3.5
VCC: C1.2 C2.2 C3.1 NOREF.1 R1.1 U1.14 U1.17 U3.4
RXD: NOREF#3.2 U1.11
TEMP: NOREF#2.1 U3.3
TXD: NOREF#6.2 U1.12
$1N5136: R1.2 U1.2
$1N6346: R2.1 U1.5

Pads without a net: NOREF#5 2; U1 1 3 4 6 7 9 10 13 15 18 19 20

## Via types
v1: diameter 0.61, hole 0.305, Top Layer to Bottom Layer, 6 vias

## Routing (per net, layer and track width the routed paths; a pad name or vN(x,y) marks a point on that pad's centre or on a via; arc(x,y) is an arc through that point)
GND: length 1.1
  Top Layer w0.254: C3.2 2.35,9.15 2.3,9.2
  vias: v1(1.65,9.15) v1(5.97,5.09) v1(8.36,13.58) v1(10.92,9.54)
VCC: length 36.6
  Top Layer w0.254: 1,7.94 0.95,7.89 ; 1,9.2 1,8.19 C3.1 ; U1.17 9.81,9.2 9.81,9.26 11.11,10.55 11.75,10.55 C2.2 12.19,9.96 11.46,9.23 11.46,6.91 11.18,6.62 10.06,6.62 U1.14
  Top Layer w0.381: 2.53,6.92 1.86,6.92 0.89,7.89 ; 2.53,6.92 2.53,5.7 3.5,4.73 NOREF.1 ; 2.53,6.92 2.85,7.25 3.24,7.25 3.43,7.44 3.43,8.01 3.52,8.1 3.52,9.25 ; C2.2 12.19,12.26 12.26,12.33 ; 12.26,12.33 13.97,10.62 C1.2 ; 12.26,12.33 4.57,12.33 3.52,11.28 3.52,9.25 ; 3.52,9.25 4.42,10.15 4.67,10.15
RXD: length 3.8
  Top Layer w0.254: 8.37,5.55 7.27,4.46 6.56,4.46 NOREF#3.2
TEMP: length 4.2
  Top Layer w0.254: U3.3 1,11.75 1.36,12.1 2.81,12.1 NOREF#2.1
TXD: length 3.4
  Top Layer w0.254: NOREF#6.2 9.14,5.04 9.14,5.73 8.86,6.01 U1.12
$1N5136: length 1.7
  Top Layer w0.254: R1.2 6.32,10.76 6.32,10.67 6.64,10.36 U1.2
$1N6346: length 12
  Top Layer w0.254: U1.5 4.21,8.67 v1(4.19,8.65) ; v1(12.45,5.22) 13.71,5.22 R2.1
  Bottom Layer w0.254: v1(12.45,5.22) 7.62,5.22 v1(4.19,8.65)

## Copper pours and planes (outline as drawn; the poured copper is in the pictures)
GND on Top Layer: -0.38,15.25 15.62,15.25 15.62,-0.24 -0.38,-0.24
GND on Bottom Layer: -0.51,15.13 15.24,15.13 15.24,-0.11 -0.51,-0.11

## Text on the board
Bottom Silkscreen Layer: v0.2 | andrew and sam / hack club apex 2025 | stratospore / fluorescence sensor
Top Silkscreen Layer: VCC | RXD | TXD | INT | GND | TEMP

# Board PCB1
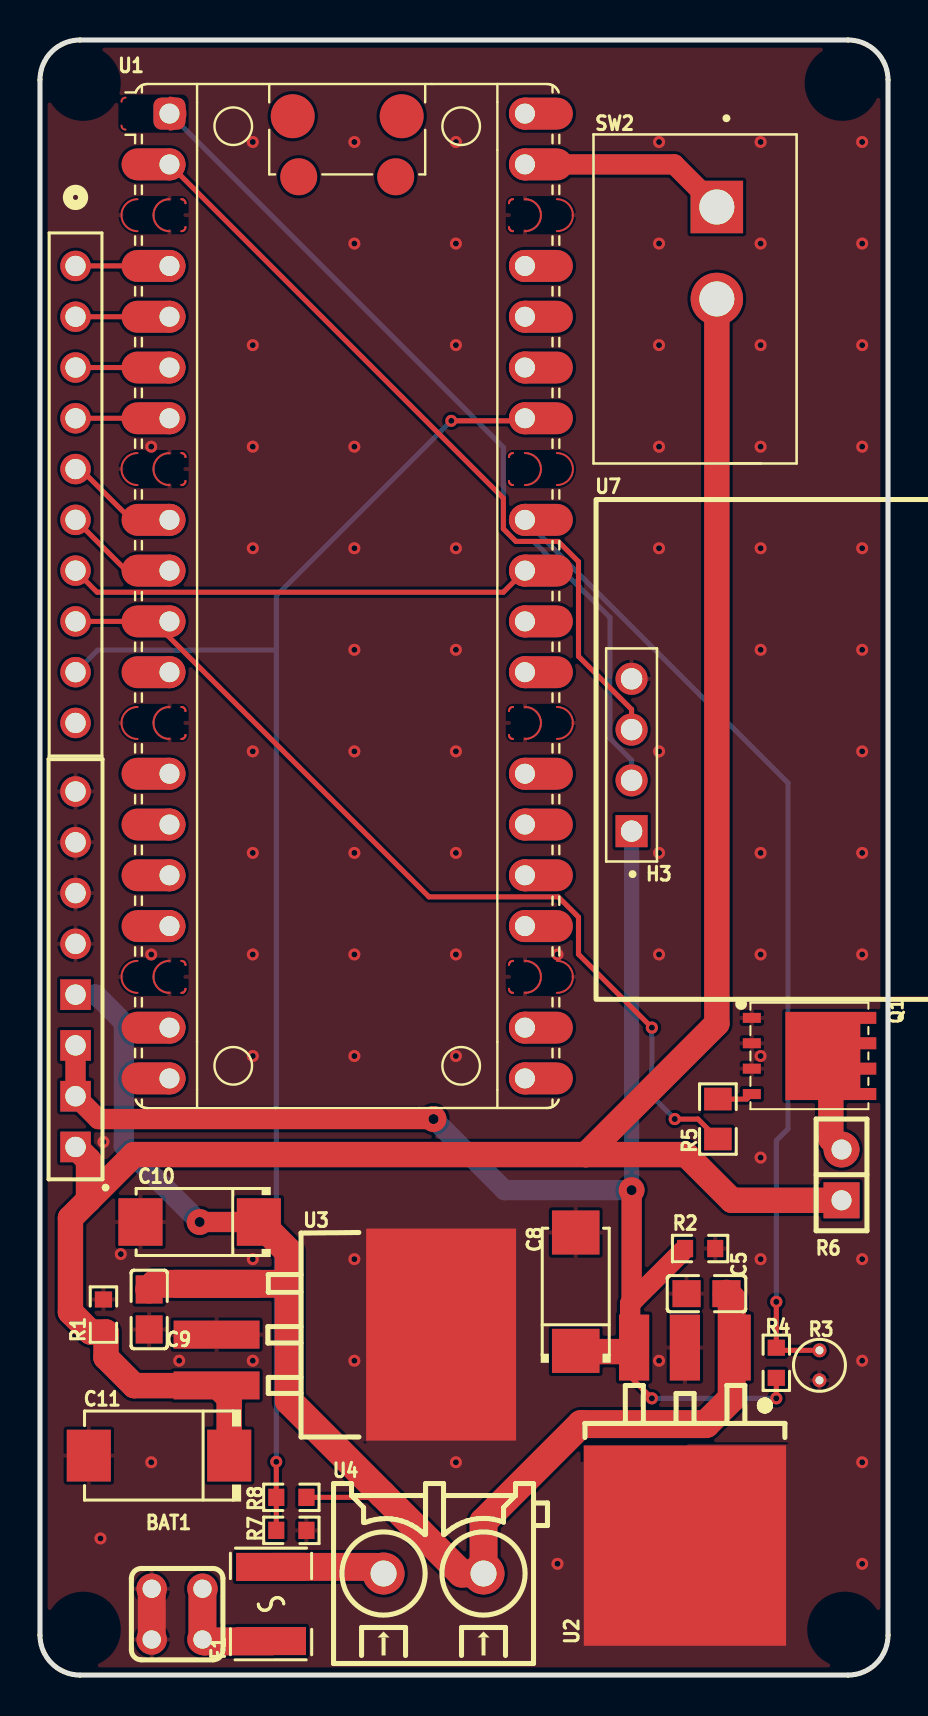
[diagram p5: board, top side]
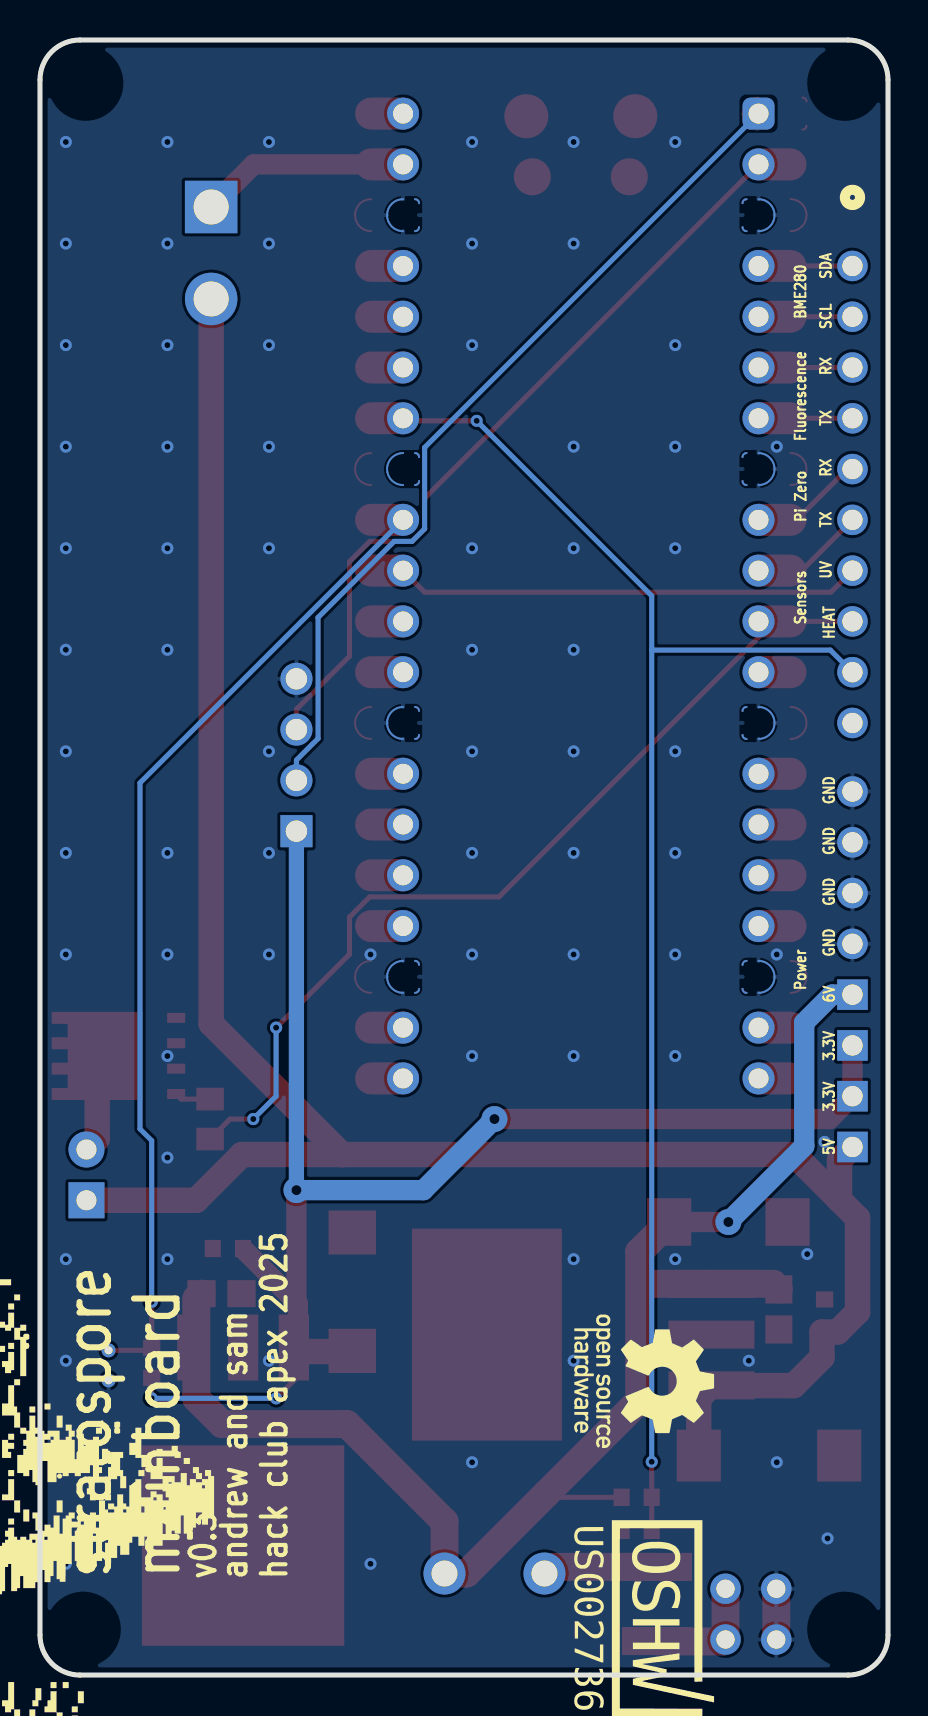
[diagram p6: board, bottom side, seen from below]

Outline 42.42 x 81.79 mm; copper layers: Top Layer, Bottom Layer. Coordinates in mm from the lower left corner of the outline.
Outline path: 0,79.79 0,2 arc(0.59,0.59) 2,0 40.42,0 arc(41.83,0.59) 42.42,2 42.42,79.79 arc(41.83,81.2) 40.42,81.79 2,81.79 arc(0.59,81.2) 0,79.79
Stack: Top Layer 0.0711mm / Dielectric1 0.71mm FR4 er 4.5 / Bottom Layer 0.0711mm

## Design rules (mm)
template: OSH Park 0.8mm 2oz
spacing copperThickness1oz (default): track to track 0.102, other pairs 0.152 to 0.3
spacing copperThickness2oz: track to track 0.152, other pairs 0.152 to 0.381
track width copperThickness1oz (default): min 0.127, default 0.254, max 2.54
track width copperThickness2oz: min 0.152, default 0.254, max 2.54
differential pair differentialPair (default): width min 0.152, default 0.254, max 2.54; gap min 0.152, default 0.152
via viaSize (default): diameter min 0.508, default 0.6, max 10; hole min 0.254, default 0.3, max 6.3

## Placement (name value [footprint] x y rotation side)
BAT1  -  [2478]  5.59 4.32 0 top
C5  1uF  [C0805]  33.34 19.08 0 top
C8  10uF  [CAP-SMD_L6.0-W3.2-R-RD]  26.8 19.18 270 top
C9  1uF  [C0805]  5.46 18.29 90 top
C10  10uF  [CAP-SMD_L6.0-W3.2-R-RD]  7.99 22.66 0 top
C11  47uF  [CAP-SMD_L7.3-W4.3-R-RD]  5.95 10.98 0 top
F1  MINISMDC150F/12-2  [F1812]  11.56 3.56 90 top
H3  PPTC041LFBN-RC  [SULLINS_PPTC041LFBN-RC]  29.59 46.02 90 top
H4  RS1-10-G  [CONN_RS1-10-G_ADM]  1.78 70.48 270 top
H7  6130XX11821_61300811821  [61300811821]  1.78 35.31 90 top
Q1  ISC073N12LM6ATMA1  [TDSON-8_L5.9-W5.2-P1.27-BL]  37.38 30.97 270 top
R1  499Ω  [R0603]  3.18 18.03 90 top
R2  330Ω  [R0603]  33.02 21.34 0 top
R3  B57861S0103F045  [RES-TH_BD2.4-P1.50-D0.3]  38.99 15.49 270 top
R4  10kΩ  [R0603]  36.83 15.62 90 top
R5  220Ω  [R0805]  33.91 27.81 90 top
R6  -  [1481]  39.88 25.02 90 top
R7  8.2kΩ  [R0603]  12.57 7.24 180 top
R8  10kΩ  [R0603]  12.57 8.89 180 top
SW2  GF-123-0054  [SW_GF-123-0054]  32.77 68.83 270 top
U1  RaspberryPi_Pico  [RaspberryPi_Pico_Common]  15.37 53.98 0 top
U2  MIC29300-3.3WU-TR  [TO-263-3_L8.6-W10.2-P2.54-LS14.4-BR]  32.26 11.43 90 top
U3  MIC29300-5.0WU-TR  [TO-263-3L_L10.2-W8.7-P2.54-LS15.3-BL-A]  14.45 17.03 270 top
U4  1935776  [CONN-TH_2P-P5.00_1935776]  19.69 5.08 0 top
U7  -  [neo 6m breakout]  45.34 46.48 0 top

## Footprints (pads in the part's own frame, mm; a bottom-side part is the same pattern mirrored in y, then rotated)
1481
  rect 1.8x1.8 hole 1: 1(-1.27,-0.215)
  round 1.8 hole 1: 2(1.27,-0.215)
2478
  round 1.524 hole 0.914: N(2.54,0) N(2.54,-2.54) P(0,0) P(0,-2.54)
61300811821
  rect 1.53x1.53 hole 1.02: 1(-8.89,0) 2(-6.35,0) 3(-3.81,0) 4(-1.27,0)
  round 1.53 hole 1.02: 5(1.27,0) 6(3.81,0) 7(6.35,0) 8(8.89,0)
C0805
  rect 1.41x1.35 smd: 1(-1,0) 2(1,0)
CAP-SMD_L6.0-W3.2-R-RD
  rect 2.208x2.376 smd: 1(2.961,0) 2(-2.961,0)
CAP-SMD_L7.3-W4.3-R-RD
  rect 2.208x2.592 smd: 1(3.511,0) 2(-3.511,0)
CONN-TH_2P-P5.00_1935776
  round 2.1 hole 1.3: 1(-2.5,0) 2(2.5,0)
CONN_RS1-10-G_ADM
  round 1.524 hole 1.016: 1(0,0) 2(2.54,0) 3(5.08,0) 4(7.62,0) 5(10.16,0) 6(12.7,0) 7(15.24,0) 8(17.78,0) 9(20.32,0) 10(22.86,0)
F1812
  rect 1.407x3.499 smd: 1(-1.853,0) 2(1.853,0)
R0603
  rect 0.806x0.864 smd: 1(-0.753,0) 2(0.753,0)
R0805
  rect 1.133x1.377 smd: 1(-1,0) 2(1,0)
RaspberryPi_Pico_Common
  round 2.2 smd: (-2.725,24) (2.725,24)
  round 1.85 smd: (-2.425,20.97) (2.425,20.97)
  custom 3.2x1.6 smd: 1(-8.89,24.13) 3(-8.89,19.05) 8(-8.89,6.35) 13(-8.89,-6.35) 18(-8.89,-19.05) 23(8.89,-19.05) 28(8.89,-6.35) 33(8.89,6.35) 38(8.89,19.05)
  rrect 1.6x1.6 hole 1: 1(-8.89,24.13)
  rrect 3.2x1.6 smd: 2(-9.69,21.59) 4(-9.69,16.51) 5(-9.69,13.97) 6(-9.69,11.43) 7(-9.69,8.89) 9(-9.69,3.81) 10(-9.69,1.27) 11(-9.69,-1.27) 12(-9.69,-3.81) 14(-9.69,-8.89) 15(-9.69,-11.43) 16(-9.69,-13.97) 17(-9.69,-16.51) 19(-9.69,-21.59) 20(-9.69,-24.13) 21(9.69,-24.13) 22(9.69,-21.59) 24(9.69,-16.51) 25(9.69,-13.97) 26(9.69,-11.43) 27(9.69,-8.89) 29(9.69,-3.81) 30(9.69,-1.27) 31(9.69,1.27) 32(9.69,3.81) 34(9.69,8.89) 35(9.69,11.43) 36(9.69,13.97) 37(9.69,16.51) 39(9.69,21.59) 40(9.69,24.13)
  round 1.6 hole 1: 2(-8.89,21.59) 4(-8.89,16.51) 5(-8.89,13.97) 6(-8.89,11.43) 7(-8.89,8.89) 9(-8.89,3.81) 10(-8.89,1.27) 11(-8.89,-1.27) 12(-8.89,-3.81) 14(-8.89,-8.89) 15(-8.89,-11.43) 16(-8.89,-13.97) 17(-8.89,-16.51) 19(-8.89,-21.59) 20(-8.89,-24.13) 21(8.89,-24.13) 22(8.89,-21.59) 24(8.89,-16.51) 25(8.89,-13.97) 26(8.89,-11.43) 27(8.89,-8.89) 29(8.89,-3.81) 30(8.89,-1.27) 31(8.89,1.27) 32(8.89,3.81) 34(8.89,8.89) 35(8.89,11.43) 36(8.89,13.97) 37(8.89,16.51) 39(8.89,21.59) 40(8.89,24.13)
  custom 1.6x1.6 hole 1: 3(-8.89,19.05) 8(-8.89,6.35) 13(-8.89,-6.35) 18(-8.89,-19.05) 23(8.89,-19.05) 28(8.89,-6.35) 33(8.89,6.35) 38(8.89,19.05)
RES-TH_BD2.4-P1.50-D0.3
  round 0.7 hole 0.4: 1(-0.75,0) 2(0.75,0)
SULLINS_PPTC041LFBN-RC
  rect 1.605x1.605 hole 1.07: 1(-3.81,0)
  round 1.605 hole 1.07: 2(-1.27,0) 3(1.27,0) 4(3.81,0)
SW_GF-123-0054
  rect 2.625x2.625 hole 1.75: 1(-4.6,1.09)
  round 2.625 hole 1.75: 2(0,1.09)
TDSON-8_L5.9-W5.2-P1.27-BL
  rect 0.5x0.9 smd: 1(-1.905,-1.775) 2(-0.635,-1.775) 3(0.635,-1.775) 4(1.905,-1.775)
  custom 4.41x4.55 smd: 5(0,1.775)
TO-263-3_L8.6-W10.2-P2.54-LS14.4-BR
  rect 3.3x1.511 smd: 1(4.952,-2.54) 2(4.952,0) 3(4.952,2.54)
  rect 10.02x10.122 smd: 4(-4.952,0)
TO-263-3L_L10.2-W8.7-P2.54-LS15.3-BL-A
  rect 1.4x4.3 smd: 1(-2.54,-5.614) 2(0,-5.615) 3(2.54,-5.615)
  rect 10.6x7.5 smd: 4(0,5.615)

## Nets
As in the schematic.

Pads without a net: U1 12 14 15 16 17 19 20 21 22 24 25 26 27 29 30 33 35 36 37 40

## Via types
v1: diameter 0.6, hole 0.3, Top Layer to Bottom Layer, 75 vias
v2: diameter 1.3, hole 0.5, Top Layer to Bottom Layer, 3 vias
v3: diameter 0.61, hole 0.305, Top Layer to Bottom Layer, 5 vias

## Routing (per net, layer and track width the routed paths; a pad name or vN(x,y) marks a point on that pad's centre or on a via; arc(x,y) is an arc through that point)
+5V: length 107.3
  Top Layer w1.27: H7.1 2.43,25.77 2.43,23.76 ; 27.31,26.04 32.32,26.04 34.6,23.75 R6.1 ; 27.31,26.04 33.86,32.59 SW2.2 ; 27.31,26.04 4.7,26.04 2.43,23.76 ; 2.43,23.76 1.52,22.86 1.52,18.16 2.52,17.16 3.3,17.16 3.3,15.89 4.72,14.48 8.82,14.48 U3.3 9.47,13.86 C11.1
+6V: length 73.9
  Top Layer w0.254: 17.13,9.04 16.98,8.89 R8.1
  Top Layer w1.016: C10.1 v2(7.99,22.66)
  Top Layer w1.397: 12.06,19.57 U3.1 5.74,19.57 C9.2 ; C5.2 34.6,18.82 34.6,13.84 33.31,12.56 27.06,12.56 22.19,7.68 U4.2 21.08,5.08 12.45,13.72 12.45,21.16 C10.1
  Bottom Layer w1.016: H7.4 2.79,34.04 4.19,32.64 4.19,26.46 v2(7.99,22.66)
GND: length 2.5
  Top Layer w1.397: BAT1.P BAT1.P
  vias: v1(3.03,6.84) v1(3.18,26.67) v1(4.04,21.06) v1(5.56,61.45) v1(5.56,36.05) v1(5.56,10.65) v1(6.96,15.72) v1(10.65,76.69) v1(10.65,66.53) v1(10.65,61.45) v1(10.65,56.37) v1(10.65,46.21) v1(10.65,41.12) v1(10.65,36.05) v1(10.65,30.97) v1(10.65,20.81) v1(10.65,15.72) v1(15.72,76.69) v1(15.72,71.61) v1(15.72,61.45) v1(15.72,56.37) v1(15.72,51.29) v1(15.72,46.21) v1(15.72,41.12) v1(15.72,36.05) v1(15.72,30.97) v1(15.72,20.81) v1(15.72,15.72) v1(20.81,76.69) v1(20.81,71.61) v1(20.81,66.53) v1(20.81,56.37) v1(20.81,51.29) v1(20.81,46.21) v1(20.81,41.12) v1(20.81,36.05) v1(20.81,30.97) v1(20.81,10.65) v1(25.88,36.05) v1(25.88,5.56) v1(30.97,76.69) v1(30.97,71.61) v1(30.97,66.53) v1(30.97,61.45) v1(30.97,56.37) v1(30.97,46.21) v1(30.97,41.12) v1(30.97,36.05) v1(30.97,15.72) v1(36.04,76.69) v1(36.04,71.61) v1(36.04,66.53) v1(36.04,61.45) v1(36.04,56.37) v1(36.04,51.29) v1(36.04,41.12) v1(36.04,36.05) v1(36.04,30.97) v1(36.04,25.89) v1(36.04,20.81) v1(41.12,76.69) v1(41.12,71.61) v1(41.12,66.53) v1(41.12,61.45) v1(41.12,56.37) v1(41.12,51.29) v1(41.12,46.21) v1(41.12,41.12) v1(41.12,36.05) v1(41.12,20.81) v1(41.12,15.72) v1(41.12,10.65) v1(41.12,5.56)
VCC: length 74.7
  Top Layer w0.254: v3(30.61,13.84) 29.52,14.93 29.52,16.18 ; R4.1 v3(36.83,13.84)
  Top Layer w1.016: H7.3 H7.2 2.92,27.81 v2(19.69,27.81) ; 29.59,18.65 32.15,21.21 ; 29.59,18.65 v2(29.59,24.26) ; 29.59,18.65 29.52,18.58 29.52,16.18
  Top Layer w1.27: 29.52,16.18 26.83,16.18 C8.1
  Bottom Layer w0.254: v3(36.83,13.84) v3(30.61,13.84)
  Bottom Layer w0.762: v2(29.59,24.26) H3.1
  Bottom Layer w1.016: v2(19.69,27.81) 23.24,24.26 v2(29.59,24.26)
ALG-TEMP: length 49.3
  Top Layer w0.254: R3.1 36.96,16.24 R4.2 v3(36.83,18.67)
  Bottom Layer w0.254: 24.26,57.79 37.41,44.63 37.41,27.32 36.83,26.73 v3(36.83,18.67)
BAT-VOLT: length 73.4
  Top Layer w0.254: v1(20.57,62.74) 24.13,62.74 24.26,62.87 ; R7.2 R8.2 v1(11.82,10.67)
  Bottom Layer w0.254: 11.82,51.27 11.82,53.98 v1(20.57,62.74) ; 11.82,51.27 v1(11.82,10.67) ; 11.82,51.27 2.88,51.27 H4.9
BME280-SCL: length 3.9
  Top Layer w0.254: H4.2 U1.5
BME280-SDA: length 3.9
  Top Layer w0.254: H4.1 5.68,70.48
FL-RX: length 3.9
  Top Layer w0.254: H4.3 U1.6
FL-TX: length 3.9
  Top Layer w0.254: H4.4 U1.7
GPS-RX: length 43.4
  Bottom Layer w0.254: H3.2 29.59,45.76 28.51,46.85 28.51,52.9 24.7,56.71 23.81,56.71 23.18,57.34 23.18,61.4 U1.1
GPS-TX: length 39.1
  Top Layer w0.254: U1.2 23.18,58.86 23.18,57.34 23.81,56.71 25.92,56.71 26.94,55.69 26.94,50.96 29.59,48.3 H3.3
HEAT-PWM: length 46.8
  Top Layer w0.254: U1.11 H4.8 ; U1.11 19.46,38.93 25.92,38.93 26.94,37.91 26.94,36.06 v3(30.61,32.39) ; U1.11 U1.11 ; v3(31.75,27.81) 32.91,27.81 R5.1
  Bottom Layer w0.254: v3(30.61,32.39) 30.61,28.96 v3(31.75,27.81)
PI-RX: length 4.6
  Top Layer w0.254: U1.9 4.57,57.79 2.16,60.2 2.16,60.33
PI-TX: length 5
  Top Layer w0.254: H4.6 4.32,55.25 U1.10
UV-ANLG: length 23.4
  Top Layer w0.254: H4.7 2.86,54.17 23.18,54.17 24.26,55.25
VSYS: length 9.7
  Top Layer w1.016: U1.39 31.72,75.57 SW2.1
$1N15688: length 5.8
  Top Layer w1.397: U4.1 16.86,5.41 F1.2
$1N19014: length 1.8
  Top Layer w0.254: R5.2 35.36,28.81 Q1.4
$1N19161: length 4.9
  Top Layer w1.27: 39.56,30.97 39.56,26.83 R6.2
$1N22706: length 6
  Top Layer w1.397: BAT1.N BAT1.N 8.22,1.68 11.56,1.68

## Copper pours and planes (outline as drawn; the poured copper is in the pictures)
GND on Top Layer: 16,23.18 24.51,23.18 24.51,11.68 16,11.68
GND on Top Layer: -3.3,82.55 43.69,82.55 43.69,-3.68 -3.3,-3.68
GND on Top Layer: 16.32,18.38 24.26,18.38 24.26,11.3 16.32,11.3
GND on Top Layer: 32.38,11.56 37.72,11.56 37.72,10.43 32.38,10.43
GND on Top Layer: 26.67,10.67 37.72,10.67 37.72,0.76 26.67,0.76
GND on Bottom Layer: -1.02,82.55 42.8,82.55 42.8,-3.94 -1.02,-3.94

## Text on the board
Bottom Silkscreen Layer: HEAT | GND | 6V | 3.3V | 5V | SDA | SCL | RX | TX | UV | Pi Zero | BME280 | Fluorescence | Sensors | Power | andrew and sam / hack club apex 2025 | v0.3 | stratospore / mainboard

# Board PCB4
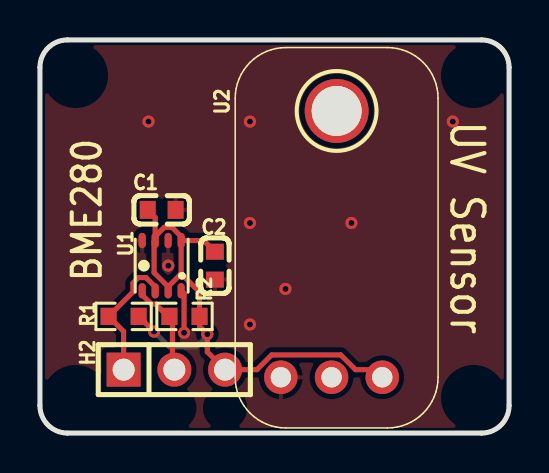
[diagram p7: board, top side]
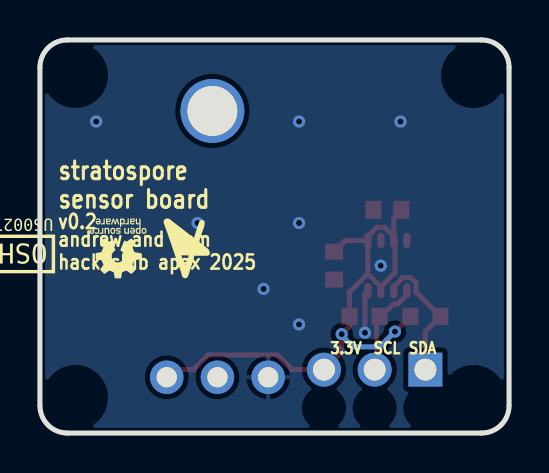
[diagram p8: board, bottom side, seen from below]

Outline 23.5 x 19.69 mm; copper layers: Top Layer, Bottom Layer. Coordinates in mm from the lower left corner of the outline.
Outline path: 0,18.31 0,1.38 arc(0.4,0.4) 1.38,0 22.12,0 arc(23.09,0.4) 23.5,1.38 23.5,18.31 arc(23.09,19.28) 22.12,19.69 1.38,19.69 arc(0.4,19.28) 0,18.31
Stack: Top Layer 0.0711mm / Dielectric1 0.71mm FR4 er 4.5 / Bottom Layer 0.0711mm

## Design rules (mm)
template: OSH Park 0.8mm 2oz
spacing copperThickness1oz (default): track to track 0.102, other pairs 0.152 to 0.3
spacing copperThickness2oz: track to track 0.203, other pairs 0.152 to 0.3
track width copperThickness1oz (default): min 0.127, default 0.254, max 2.54
track width copperThickness2oz: min 0.203, default 0.254, max 2.54
differential pair differentialPair (default): width min 0.127, default 0.254, max 2.54; gap min 0.152, default 0.152
via viaSize (default): diameter min 0.5, default 0.61, max 10; hole min 0.3, default 0.305, max 6.3

## Placement (name value [footprint] x y rotation side)
C1  100nF  [C0603]  6.1 11.18 0 top
C2  100nF  [C0603]  8.76 8.38 270 top
H2  HTSW-103-07-T-S  [HDR-TH_3P-P2.54-V-M]  6.73 3.17 0 top
R1  4.7kΩ  [R0603]  4.19 5.84 0 top
R2  4.7kΩ  [R0603]  7.24 5.84 0 top
U1  BME280  [LGA-8_BME280_BL]  6.1 8.38 270 top
U2  -  [1918]  14.6 8.76 0 top

## Footprints (pads in the part's own frame, mm; a bottom-side part is the same pattern mirrored in y, then rotated)
1918
  round 1.677 hole 1.016: 1(2.54,-5.969) 2(0,-5.969) 3(-2.54,-5.969)
  round 3.2 hole 2.5: P$1(0.254,7.366)
C0603
  rect 0.8x0.9 smd: 1(-0.7,0) 2(0.7,0)
HDR-TH_3P-P2.54-V-M
  rect 1.7x1.7 hole 1.1: 1(-2.54,0)
  round 1.7 hole 1.1: 2(0,0) 3(2.54,0)
LGA-8_BME280_BL
  oval 0.767x0.364 smd: 1(1.258,0.975) 2(1.258,0.325) 3(1.258,-0.325) 4(1.258,-0.975) 5(-1.258,-0.975) 6(-1.258,-0.325) 7(-1.258,0.325) 8(-1.258,0.975)
R0603
  rect 0.806x0.864 smd: 1(-0.753,0) 2(0.753,0)

## Nets
As in the schematic.

Pads without a net: U2 P$1

## Via types
v1: diameter 0.61, hole 0.305, Top Layer to Bottom Layer, 11 vias

## Routing (per net, layer and track width the routed paths; a pad name or vN(x,y) marks a point on that pad's centre or on a via; arc(x,y) is an arc through that point)
GND: length 2.2
  Top Layer w0.254: v1(7.22,5.02) 7.22,6.98 U1.1
  vias: v1(5.44,15.6) v1(6.43,8.38) v1(10.52,15.6) v1(10.52,10.52) v1(10.52,5.44) v1(12.3,7.22) v1(15.6,10.52) v1(20.68,15.6)
VCC: length 29.5
  Top Layer w0.254: U2.1 16.76,3.17 15.8,3.17 15.07,3.91 11.6,3.91 10.87,3.17 H2.3 8.38,4.06 v1(8.38,4.95) 7.99,5.34 R2.2 7.99,7.06 7.07,7.98 ; 7.07,7.98 U1.8 ; 7.07,7.98 6.42,7.33 ; U1.8 8.2,9.64 C2.1 ; U1.8 7.11,9.68 7.11,9.8 6.61,10.3 6.23,10.3 5.77,9.84 5.77,10.8 C1.1 ; U1.6 5.72,9.58 5.72,8.03 6.42,7.33 ; 6.42,7.33 U1.2 ; R1.2 5.71,5.08 v1(5.72,5.08)
  Bottom Layer w0.254: v1(8.38,4.95) 8.38,4.89 7.81,4.32 6.48,4.32 v1(5.72,5.08)
SCL: length 4.8
  Top Layer w0.254: U1.4 5.12,6.92 5.58,6.46 5.78,6.46 6.4,5.84 R2.1 6.63,5.69 6.63,3.27 H2.2
SDA: length 6.8
  Top Layer w0.254: H2.1 4.19,5.09 R1.1 4.66,7.06 4.66,7.52 4.93,7.79 5.31,7.79 5.77,7.33 U1.3

## Copper pours and planes (outline as drawn; the poured copper is in the pictures)
GND on Top Layer: -0.63,19.94 24.38,19.94 24.38,-0.63 -0.63,-0.63
GND on Bottom Layer: -0.76,20.19 24,20.19 24,-0.25 -0.76,-0.25

## Text on the board
Bottom Silkscreen Layer: SDA | SCL | 3.3V | v0.2 | andrew and sam / hack club apex 2025 | stratospore / sensor board
Top Silkscreen Layer: BME280 | UV Sensor
